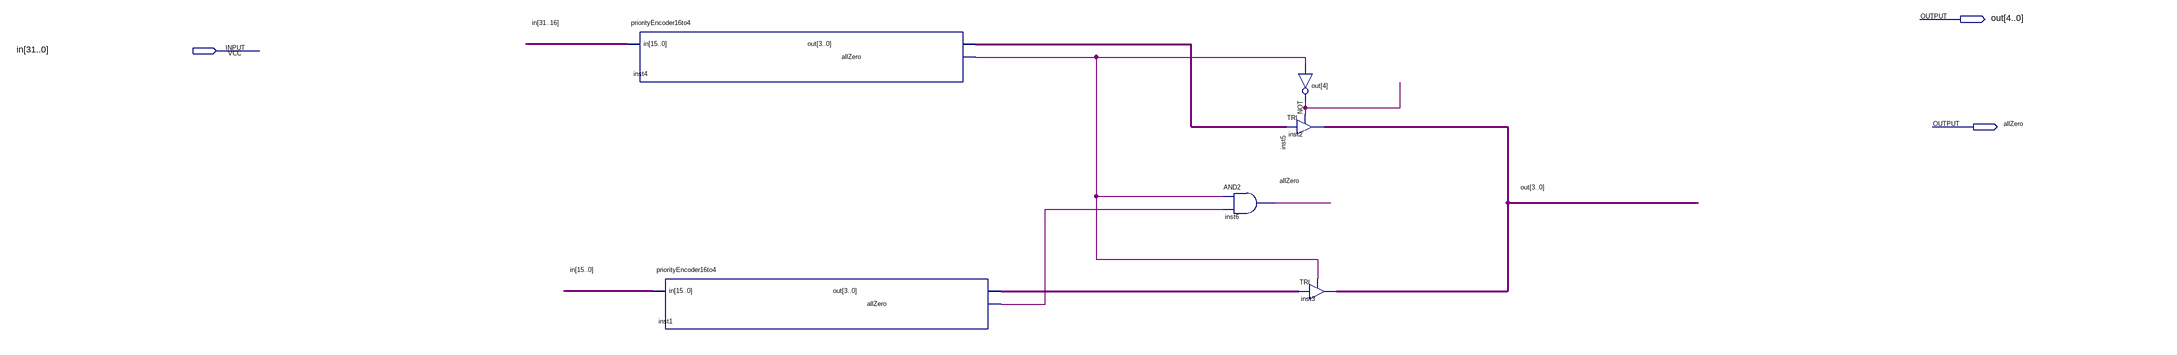
[diagram p0: schematic sheet]
// Quartus schematic priorityEncoder32bit.bdf as structural Verilog: 6 symbols, 3 pins
module priorityEncoder32bit (
  input  [31:0] in,
  output [4:0] out,
  output allZero
);

  wire inst1_allzero, inst4_allzero;
  wire [3:0] inst1_out, inst4_out;

  priorityEncoder16to4 inst4 (.in(in[31:16]), .out(inst4_out), .allZero(inst4_allzero));
  priorityEncoder16to4 inst1 (.in(in[15:0]), .out(inst1_out), .allZero(inst1_allzero));
  and inst6 (allZero, inst4_allzero, inst1_allzero);
  not inst5 (out[4], inst4_allzero);
  TRI inst2[3:0] (.IN(inst4_out), .OE(out[4]), .OUT(out[3:0]));
  TRI inst3[3:0] (.IN(inst1_out), .OE(inst4_allzero), .OUT(out[3:0]));
endmodule
